# EAGLE design CarDAC (EAGLE 7.6.0)
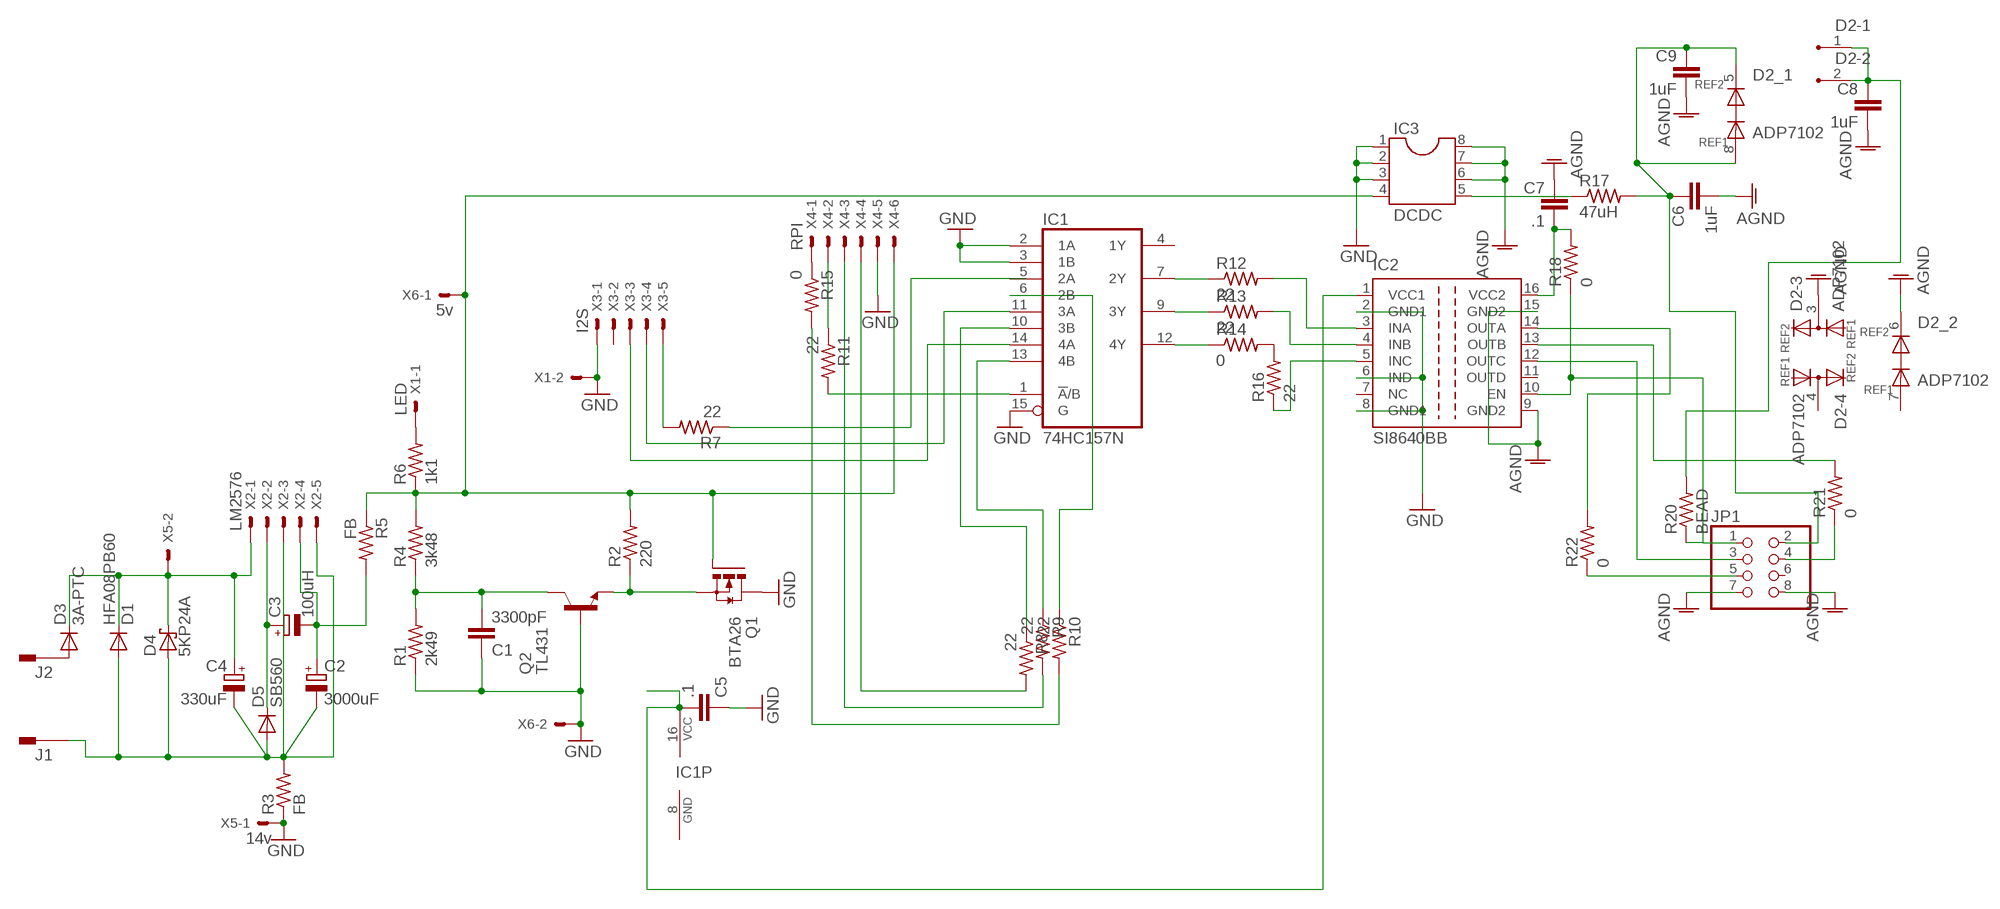
[diagram p0: schematic, sheet 1]

## Parts
C1  3300pF  C-EU050-035X075  [C050-035X075]
C2  3000uF  CPOL-EUE5-10.5  [E5-10,5]
C3  100uH  CPOL-EUB45181C  [B45181C]
C4  330uF  CPOL-EUE5-10.5  [E5-10,5]
C5  .1  C-EUC1210K  [C1210K]
C6  1uF  C-EUC1210K  [C1210K]
C7  .1  C-EUC1210K  [C1210K]
C8  1uF  C-EUC1210K  [C1210K]
C9  1uF  C-EUC1210K  [C1210K]
D1  HFA08PB60  1N5061  [SOD57-10]
D2  ADP7102  DA108S1  [SO08]
D3  3A-PTC  1N5061  [SOD57-10]
D4  5KP24A  5KPXX  [P6T15]
D5  SB560  1N5400  [DO201-15]
IC1  74HC157N  74LS157N  [DIL16]
IC2  SI8640BB  ISO7240  [SO-16DW]
IC3  DCDC  DIL8  [DIL08]
J1  PIN2F061.040  [F061.040]
J2  PIN2F061.040  [F061.040]
JP1  PINHD-2X4  [2X04]
Q1  BTA26  IRFP240  [TO247BV]
Q2  TL431  BC449  [TO92-EBC]
R1  2k49  R-US_0309/10  [0309/10]
R2  220  R-US_0309/10  [0309/10]
R3  FB  R-US_0309/10  [0309/10]
R4  3k48  R-US_0309/10  [0309/10]
R5  FB  R-US_0309/12  [0309/12]
R6  1k1  R-US_0309/10  [0309/10]
R7  22  R-US_0309/12  [0309/12]
R8  22  R-US_0207/15  [0207/15]
R9  22  R-US_0309/12  [0309/12]
R10  22  R-US_0309/12  [0309/12]
R11  22  R-US_0309/12  [0309/12]
R12  22  R-US_0309/10  [0309/10]
R13  22  R-US_0309/12  [0309/12]
R14  0  R-US_0207/15  [0207/15]
R15  0  R-US_0309/12  [0309/12]
R16  22  R-US_0207/15  [0207/15]
R17  47uH  R-US_0309/10  [0309/10]
R18  0  R-US_0309/10  [0309/10]
R20  BEAD  R-US_0309/10  [0309/10]
R21  0  R-US_0207/15  [0207/15]
R22  0  R-US_0309/10  [0309/10]
X1  LED  22-23-2021  [22-23-2021]
X2  LM2576  22-23-2051  [22-23-2051]
X3  I2S  22-23-2051  [22-23-2051]
X4  RPI  22-23-2061  [22-23-2061]
X5  14v  22-23-2021  [22-23-2021]
X6  5v  22-23-2021  [22-23-2021]

## Nets
AGND: C6.2 C7.1 C8.2 C9.2 D2.3(-3:K) D2.6(_2:REF2) IC2.9(GND2) IC2.15(GND2) IC3.6 IC3.7 IC3.8 JP1.7 JP1.8
GND: C1.1 C5.1 IC1.2(1A) IC1.3(1B) IC1.15(G) IC2.2(GND1) IC2.6(IND) IC2.8(GND1) IC3.1 IC3.2 IC3.3 Q1.D Q2.B R1.1 R3.1 X1.2 X3.1 X4.5 X5.1 X6.2
N$1: Q1.S Q2.E R2.1
N$2: IC3.4 Q1.G R2.2 R4.2 R5.1 R6.1 X4.6 X6.1
N$3: C1.2 Q2.C R1.2 R4.1
N$4: C4.+ D1.C D3.C D4.C X2.1 X5.2
N$5: D3.A J2.A1 J2.A2
N$6: C2.- C4.- D1.A D4.A D5.A J1.A1 J1.A2 R3.2 X2.3 X2.5
N$7: C3.+ D5.C X2.2
N$8: C2.+ C3.- R5.2 X2.4
N$9: R6.2 X1.1
N$10: C5.2 IC1.16(VCC) IC2.1(VCC1)
N$11: IC1.13(4B) R9.1
N$12: IC1.14(4A) X3.3
N$13: IC1.12(4Y) R14.1
N$14: IC1.10(3B) R8.1
N$15: IC1.11(3A) X3.4
N$16: IC1.6(2B) R10.1
N$17: IC1.5(2A) R7.1
N$18: R7.2 X3.5
N$19: R10.2 R15.2
N$20: IC1.1(!A!/B) R11.2
N$21: R9.2 X4.3
N$22: R8.2 X4.4
N$23: R11.1 X4.2
N$24: IC1.7(2Y) R12.1
N$25: IC1.9(3Y) R13.1
N$26: R15.1 X4.1
N$27: IC2.3(INA) R12.2
N$28: IC2.4(INB) R13.2
N$29: IC2.5(INC) R16.1
N$30: IC3.5 R17.1
N$31: R14.2 R16.2
N$32: C6.1 C9.1 D2.5(_1:REF2) D2.8(_1:REF1) JP1.2 R17.2
N$34: IC2.10(EN) JP1.1 R18.1 R20.1
N$35: C8.1 D2.1(-1:K) D2.2(-2:K) R20.2
N$36: IC2.12(OUTC) JP1.3
N$37: IC2.13(OUTB) R21.2
N$38: IC2.14(OUTA) R22.2
N$39: JP1.5 R22.1
N$40: C7.2 IC2.16(VCC2) R18.2
N$44: JP1.4 R21.1
Unconnected: D2.4(-4:K) D2.7(_2:REF1) IC1.4(1Y) IC2.7(NC) IC2.11(OUTD) JP1.6 X3.2

## Power pins joined to a net without a drawn wire
GND: IC1.8(GND)

## Library data of the parts
C1 C5-C9 = resistor:C-EU: CAPACITOR, European symbol
C2-C4 = resistor:CPOL-EU: POLARIZED CAPACITOR, European symbol
D1 D3 = diode:1N5061: DIODE controlled avalanche rectifier
D2 = st-microelectronics:DA108S1: DIODE ARRAY (ASD); MF: Arrow Electronics; MPN: DA108S1; OC_FARNELL: 9802215; OC_NEWARK: 89K0513
D4 = diode:5KPXX: DIODE transient voltage suppressor
D5 = diode:1N5400: DIODE standard rectifier, 3 A, 50 V (Motorola)
IC1 = 74xx-us:74*157: Quadruple 2-line to 1-line data SELECTOR/MULTIPLEXER
IC2 = texas:ISO7240: HIGH SPEED QUAD DIGITAL ISOLATORS Source: http://focus.ti.com/lit/ds/symlink/iso7240m.pdf; MPN: ISO7240MDW; OC_FARNELL: 1755124; OC_NEWARK: 58M0385
IC3 = ic-package:DIL8: Dual In Line / Socket
J1 J2 = con-faston:PIN2: Flachstecker Typ Tyco/Electronics/AMP TAB, FASTON Printed Circuit Board Tabs Source: http://www.buerklin.com, http://catalog.tycoelectronics.com; OC_FARNELL: unknown; OC_NEWARK: unknown
JP1 = pinhead:PINHD-2X4: PIN HEADER
Q1 = transistor-power:IRFP240: HEXFET Power MosFet Source: http://www.irf.com/
Q2 = transistor-npn:BC449*: NPN Transistor
R1-R18 R20-R22 = resistor:R-US_: RESISTOR, American symbol
X1 X5 X6 = con-molex:22-23-2021: .100" (2.54mm) Center Header - 2 Pin; MF: MOLEX; MPN: 22-23-2021; OC_FARNELL: 1462926; OC_NEWARK: 25C3832
X2 X3 = con-molex:22-23-2051: .100" (2.54mm) Center Header - 5 Pin; MF: MOLEX; MPN: 22-23-2051; OC_FARNELL: 1462952; OC_NEWARK: 38C9178
X4 = con-molex:22-23-2061: .100" (2.54mm) Center Header - 6 Pin; MF: MOLEX; MPN: 22-23-2061; OC_FARNELL: 1462922; OC_NEWARK: 27C1933

## Board
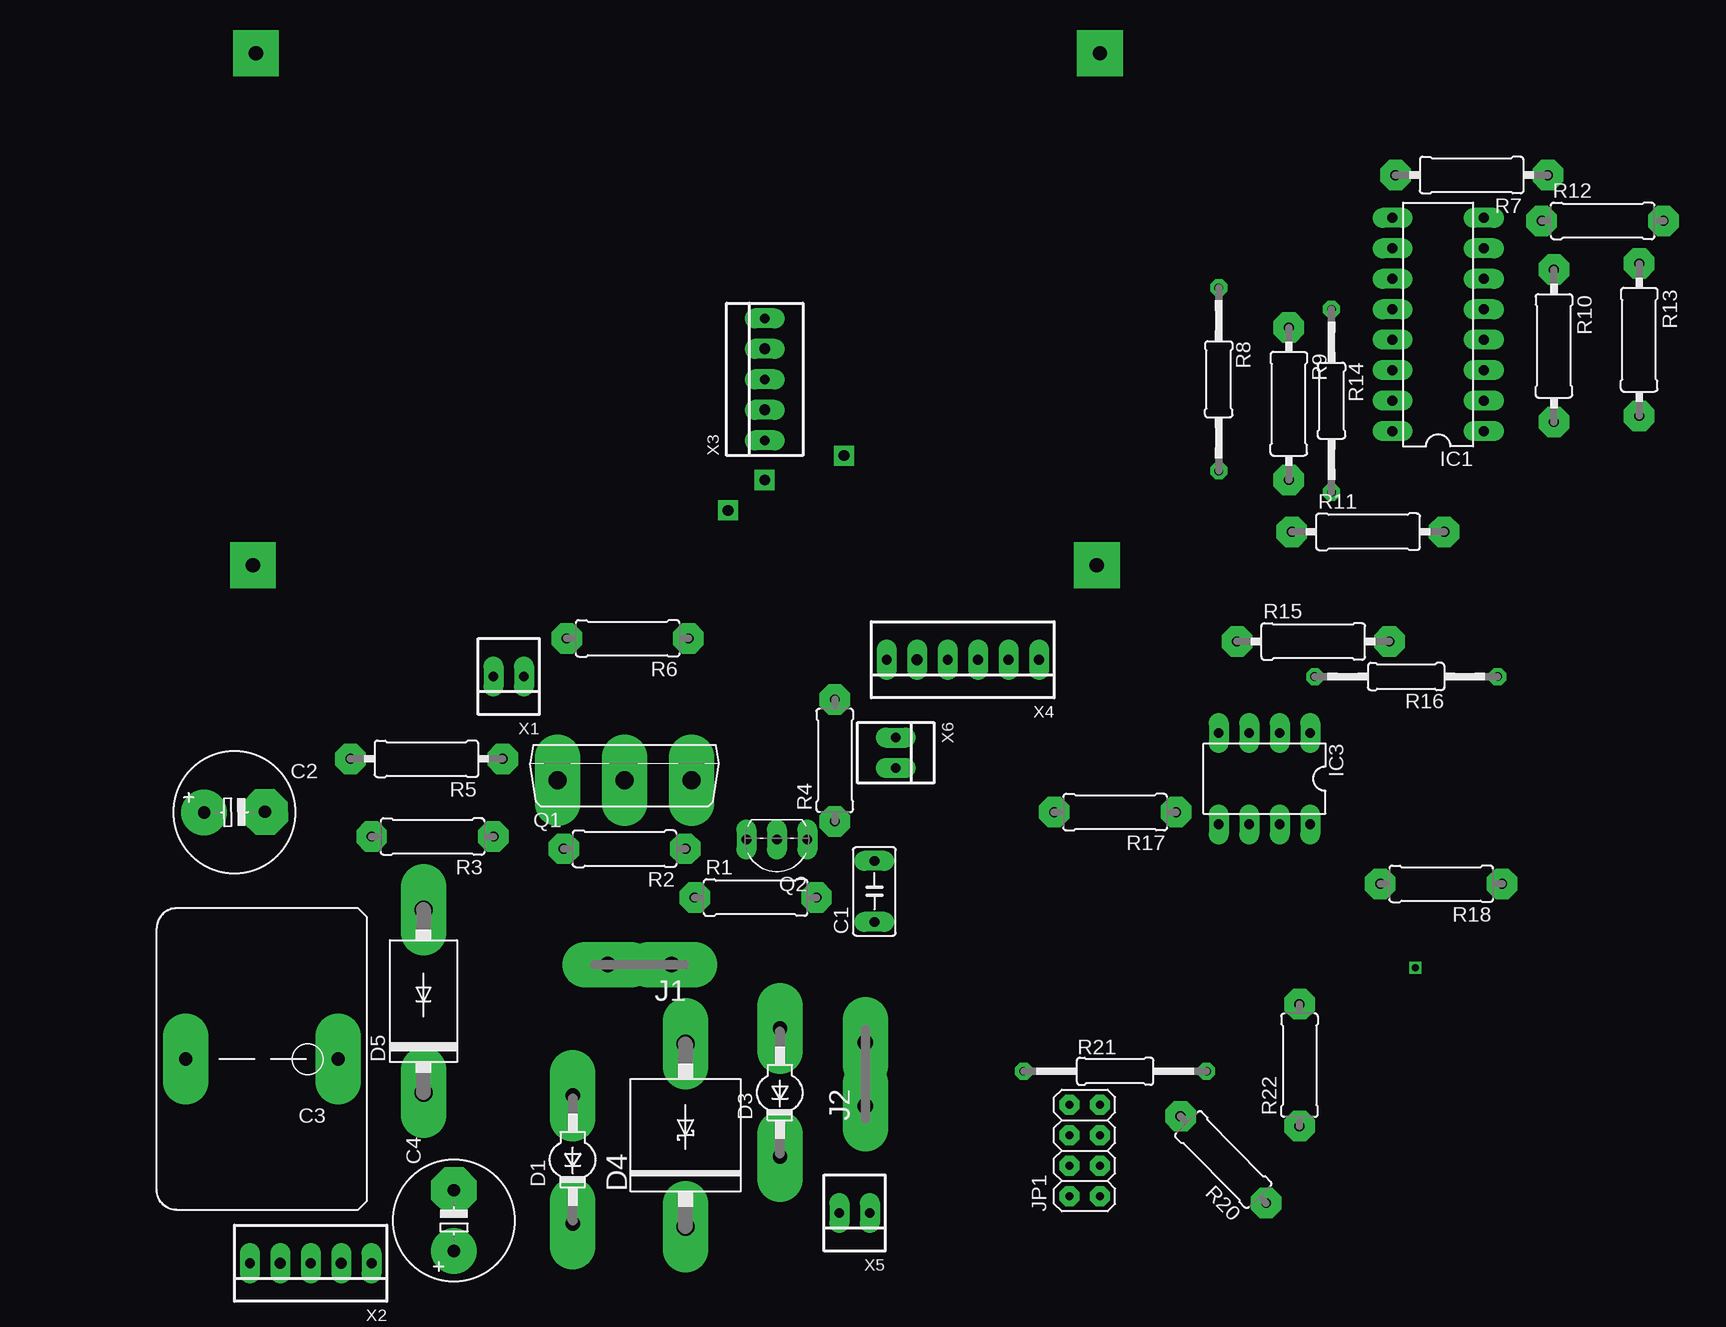
[diagram p1: board, top side]
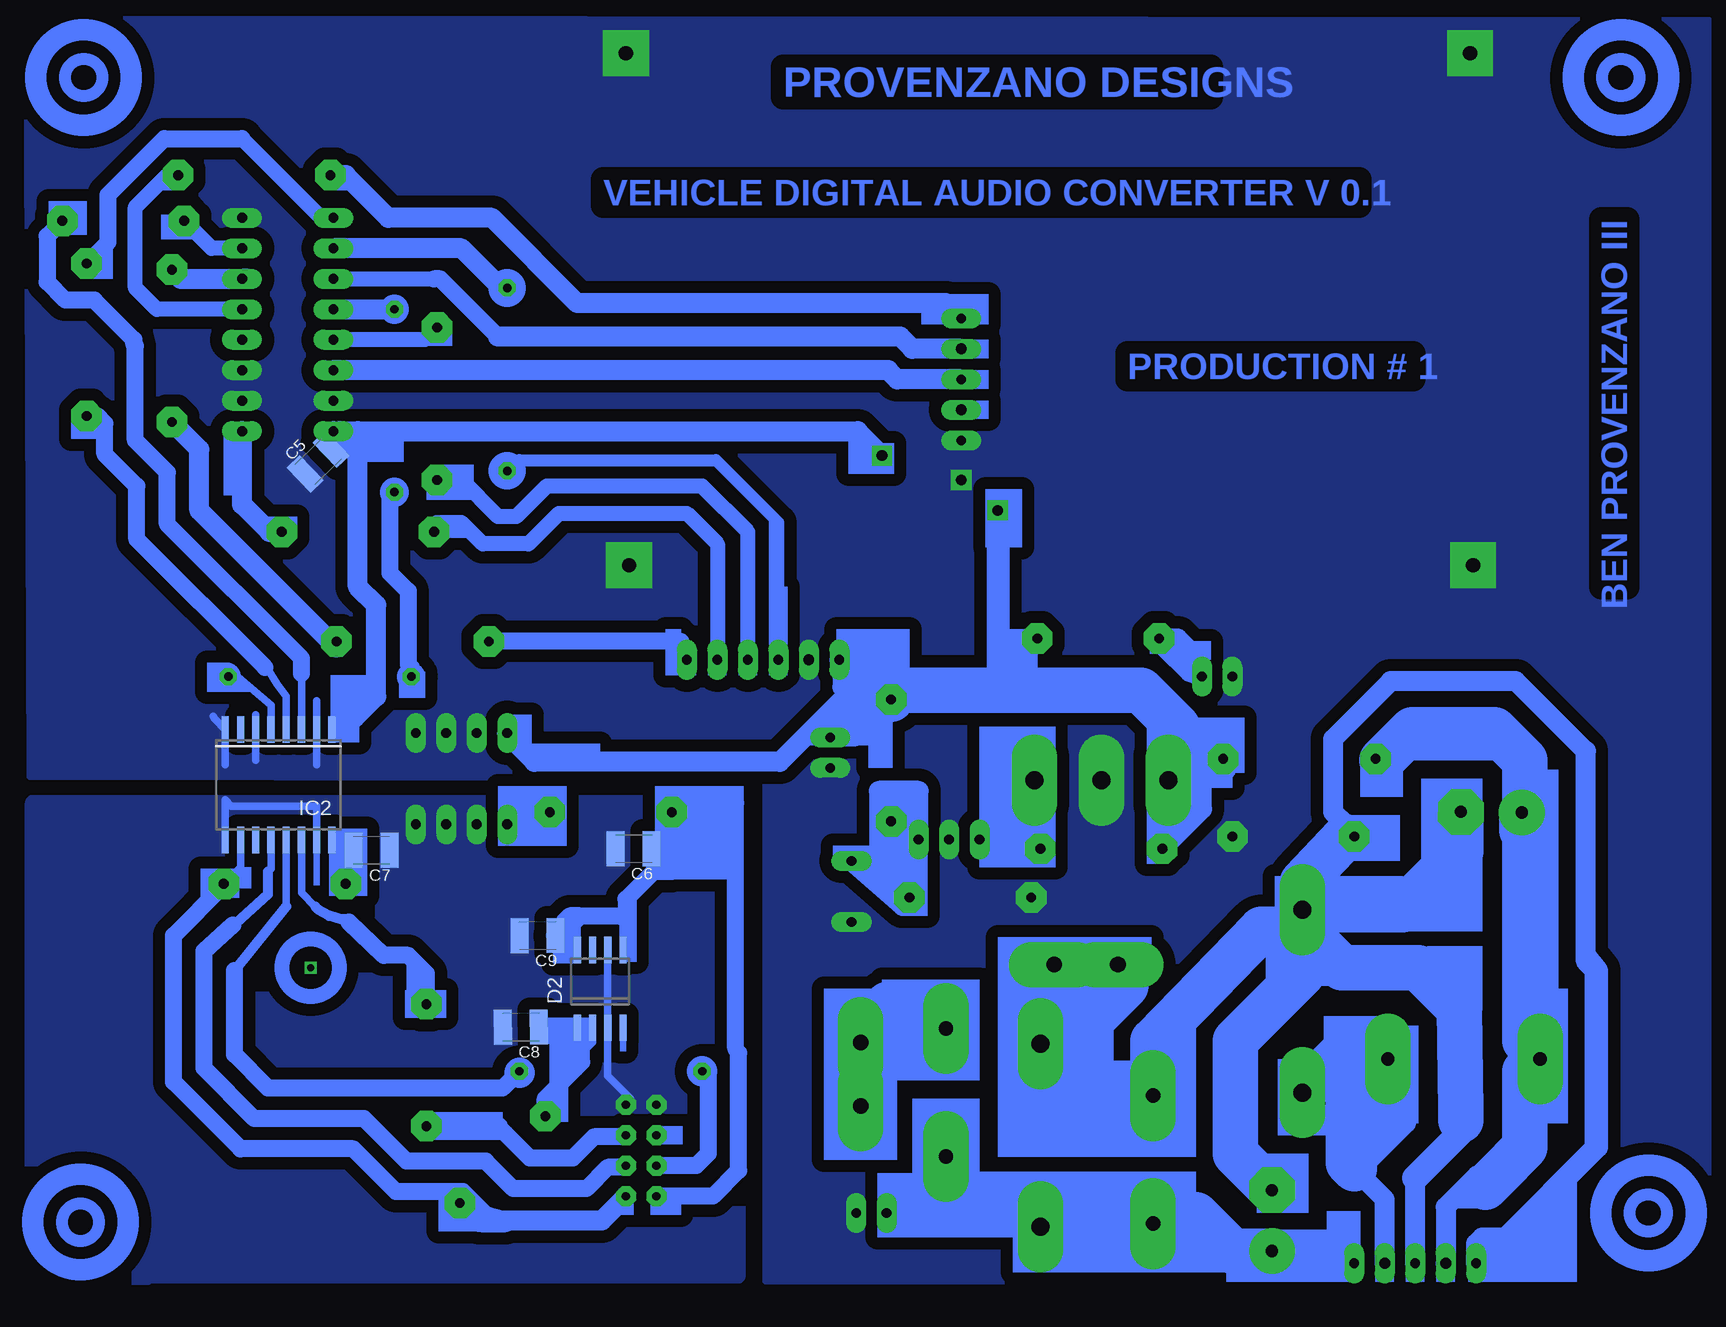
[diagram p2: board, bottom side, seen from below]

No outline drawn. Coordinates in mm, seen from the top.
Copper layers (1*16): Top 0.035mm / dielectric 1.5mm / Bottom 0.035mm
Design rules "default": minimum track width 10mil, minimum drill 24mil, track to track 8mil, track to pad 8mil, pad to pad 8mil, via to via 8mil, smd to smd 8mil, copper to edge 40mil, drill to drill 8mil, minimum pad ring 10mil, minimum via ring 8mil, stop-mask expansion 4mil, vias tented up to drill 0mil, thermal gap 10mil

### Footprints (pad centres in the part's own frame; a part is rotated, then mirrored left to right if it is on the bottom)
C050-035X075 = drill 0.813 pad 1.676 long: 1 -2.54,0; 2 2.54,0
E5-10,5 = drill 1.016 pad 3.81: + -2.54,0 | drill 1.016 pad 3.81 octagon: - 2.54,0
B45181C = drill 1.1 pad 3.81 long: + -6.35,0; - 6.35,0
C1210K = smd 1.5 x 2.9: 1 -1.5,0; 2 1.5,0
SOD57-10 = drill 1.194 pad 3.81 long: A 5.334,0; C -5.334,0
SO08 = smd 0.6 x 2.2: 1 -1.905,-3.87; 2 -0.635,-3.87; 3 0.635,-3.87; 4 1.905,-3.87; 5 1.905,2.6; 6 0.635,2.6; 7 -0.635,2.6; 8 -1.905,2.6
P6T15 = drill 1.499 pad 3.81 long: A 7.62,0; C -7.62,0
DO201-15 = drill 1.499 pad 3.81 long: A 7.62,0; C -7.62,0
DIL16 = drill 0.813 pad 1.676 long: 1 -8.89,-3.81; 2 -6.35,-3.81; 3 -3.81,-3.81; 4 -1.27,-3.81; 5 1.27,-3.81; 6 3.81,-3.81; 7 6.35,-3.81; 8 8.89,-3.81; 9 8.89,3.81; 10 6.35,3.81; 11 3.81,3.81; 12 1.27,3.81; 13 -1.27,3.81; 14 -3.81,3.81; 15 -6.35,3.81; 16 -8.89,3.81
SO-16DW = smd 0.6 x 2.2: 1 -4.445,-4.6; 2 -3.175,-4.6; 3 -1.905,-4.6; 4 -0.635,-4.6; 5 0.635,-4.6; 6 1.905,-4.6; 7 3.175,-4.6; 8 4.445,-4.6; 9 4.445,4.6; 10 3.175,4.6; 11 1.905,4.6; 12 0.635,4.6; 13 -0.635,4.6; 14 -1.905,4.6; 15 -3.175,4.6; 16 -4.445,4.6
DIL08 = drill 0.813 pad 1.676 long: 1 -3.81,-3.81; 2 -1.27,-3.81; 3 1.27,-3.81; 4 3.81,-3.81; 5 3.81,3.81; 6 1.27,3.81; 7 -1.27,3.81; 8 -3.81,3.81
F061.040 = drill 1.3 pad 3.81 long: A1 -2.65,0; A2 2.65,0
2X04 = drill 0.7 pad 1.676 octagon: 1 -3.81,-1.27; 2 -3.81,1.27; 3 -1.27,-1.27; 4 -1.27,1.27; 5 1.27,-1.27; 6 1.27,1.27; 7 3.81,-1.27; 8 3.81,1.27
TO247BV = drill 1.499 pad 3.81 long: D 0,-2.921; G -5.588,-2.921; S 5.588,-2.921
TO92-EBC = drill 0.813 pad 1.676 long: B 0,-1.27; C -2.54,-1.27; E 2.54,-1.27
0309/10 = drill 0.813 pad 2.54 octagon: 1 -5.08,0; 2 5.08,0
0309/12 = drill 0.813 pad 2.54 octagon: 1 -6.35,0; 2 6.35,0
0207/15 = drill 0.7 pad 1.422 octagon: 1 -7.62,0; 2 7.62,0
22-23-2021 = drill 0.8 pad 1.676 long: 1 -1.27,0; 2 1.27,0
22-23-2051 = drill 0.8 pad 1.676 long: 1 -5.08,0; 3 0,0; 5 5.08,0 | drill 0.9 pad 1.676 long: 2 -2.54,0; 4 2.54,0
22-23-2061 = drill 0.8 pad 1.676 long: 1 -6.35,0; 2 -3.81,0; 3 -1.27,0; 4 1.27,0; 6 6.35,0 | drill 0.9 pad 1.676 long: 5 3.81,0

### Placement (x,y rotation side)
C1  87.88,55.12 90 top
C2  34.54,61.72 0.6 top
C3  36.83,41.15 180 top
C4  52.83,27.69 90 top
C5  132.33,90.93 43.8 bottom
C6  106.05,58.67 180 bottom
C7  127.89,58.55 180 bottom
C8  115.44,43.81 180.3 bottom
C9  114.05,51.44 180.2 bottom
D1  62.74,32.77 90 top
D2  108.84,47.62 0 bottom
D3  80.01,38.35 90 top
D4  72.14,34.8 90 top
D5  50.29,45.97 90 top
IC1  134.87,102.36 90 top
IC2  135.64,64.01 180 bottom
IC3  120.4,64.52 180 top
J1  68.33,49.02 180 top
J2  87.12,39.88 90 top
JP1  105.41,33.53 90 top
Q1  67.06,67.31 0 top
Q2  79.76,58.17 180 top
R1  77.98,54.61 0 top
R2  67.06,58.67 180 top
R3  51.05,59.69 180 top
R4  84.58,66.04 90 top
R5  50.55,66.17 180 top
R6  67.31,76.2 180 top
R7  137.67,114.81 180 top
R8  116.59,97.79 270 top
R9  122.43,95.76 270 top
R10  144.53,100.58 270 top
R11  129.03,85.09 0 top
R12  148.59,111 0 top
R13  151.64,101.09 270 top
R14  125.98,96.01 270 top
R15  124.46,75.95 0 top
R16  132.21,73.03 180 top
R17  107.95,61.72 180 top
R18  135.13,55.75 180 top
R20  116.97,32.77 134.6 top
R21  107.95,40.13 0 top
R22  123.32,40.64 90 top
X1  57.4,73.03 180 top
X2  40.89,24.13 180 top
X3  78.74,97.79 90 top
X4  95.25,74.42 180 top
X5  86.23,28.32 180 top
X6  89.66,66.67 270 top

### Tracks (layer width: path | path; a pad name or v marks a point on that pad's centre or on a via)
AGND
  Bottom 0.61: IC2.15 132.46,62.23 139.57,62.23 140.08,62.74 IC2.9 | D2.3 108.2,41.15 | D2.6 D2.3 | D2.3 108.2,39.75 106.3,37.85
  pour Bottom (isolate 1.016, no thermals): 97.41,62.48 97.41,23.11 146.69,23.11 146.69,22.99 156.08,22.99 156.08,62.48
GND  (via drill 0.9 pad 1.68, 1.2 pad 3.81)
  Bottom 0.61: 141.1,69.72 140.97,69.5 IC2.8 140.08,65.66 | 137.54,66.04 IC2.6 137.54,69.85 | 132.46,65.66 IC2.2 132.46,70.99
  other vias: 36.32,124.97 36.07,82.3 106.68,124.97 106.43,82.3 78.74,89.41
  pour Bottom (isolate 1.016, no thermals): 16.38,127.76 156.72,127.89 156.46,64.64 95.12,64.52 95.12,22.61 16.38,22.61
N$1
  Bottom 1.676: 74.68,60.96 74.68,62.36 Q1.S | Q2.E 74.68,60.96 | R2.1 74.68,60.96
N$2  (via drill 0.9 pad 1.68)
  Bottom 1.422: X6.1 87.5,67.94 87.5,72.14
  Bottom 1.676: 61.98,63.88 Q1.G 61.47,65.02 61.72,65.28 58.67,65.28 | R5.1 56.64,65.28 58.67,65.28 | R2.2 58.67,61.98 58.67,65.28 | X4.6 88.65,75.44 88.65,72.14 88.27,72.14 | 88.27,72.14 87.5,72.14 83.06,72.14 83.06,71.88 | R6.1 72.39,75.95 75.69,72.64 | 88.27,72.14 88.27,71.5 93.85,65.91 114.3,65.91 116.59,68.2 IC3.4
  Bottom 1.93: v75.69,86.87 75.69,72.64 75.69,71.88
  Bottom 3.81: Q1.G 60.71,65.15 60.71,68.83 63.75,71.88 75.69,71.88 83.06,71.88 84.58,71.88 R4.2
N$3
  Bottom 1.676: Q2.C 82.3,63.5 85.6,63.5 85.6,57.91 83.6,55.91 83.6,53.91 | R1.2 83.57,57.15 C1.2 83.6,53.91 | 83.6,53.91 R4.1
N$4
  Bottom 1.422: X5.2 80.64,28.32 80.01,28.19
  Bottom 1.676: X2.1 46.48,25.15 53.34,25.15
  Bottom 3.81: C4.+ 53.34,25.15 56.13,25.15 59.18,28.19 62.74,28.19 | 62.74,28.19 71.88,28.19 | D1.C 62.74,28.19 | D4.C 71.88,28.19 | 71.88,28.19 80.01,28.19 D3.C
N$5
  Bottom 3.81: J2.A1 J2.A2 87.12,43.43 84.84,45.72 D3.A
N$6
  Bottom 1.422: 46.74,59.69 R3.2
  Bottom 1.676: X2.3 40.89,31.24 | 26.67,49.78 26.67,49.28 25.91,48.51 25.91,33.78 33.4,26.29 35.31,26.29 35.81,25.78 X2.5 34.54,24.64 33.27,25.91 33.27,26.16 25.65,33.78 25.65,48.51 26.67,49.78 | 26.67,49.78 26.67,66.8 32.51,72.64 42.93,72.64 47.75,67.82 47.75,61.72 46.74,60.71 46.74,59.69
  Bottom 2.184: 40.89,31.24 37.09,35.04 37.09,36.82
  Bottom 3.81: 50.29,53.09 49.95,51.96 53.7,51.96 62.74,42.67 62.74,39.12 | 46.74,59.69 50.29,55.88 D5.A | 50.29,53.09 D5.A | C4.- 55.88,33.27 55.88,42.67 50.29,48.26 50.29,52.07 | 62.74,39.12 D1.A | 62.74,39.12 69.09,39.12 D4.A 70.36,41.91 65.02,47.24 65.02,48.37 J1.A2 J1.A1 | 37.08,36.07 37.09,36.82 37.21,45.34 40.64,48.77 46.99,48.77 50.29,52.07 | 50.29,52.07 50.29,53.09 | D5.A 41.97,53.59 37.08,58.48 C2.-
N$7
  Bottom 1.676: X2.2 43.43,29.46 45.72,31.75 41.66,35.81 41.66,39.37 43.18,40.89 C3.+
  Bottom 3.81: 45.97,32 46.48,32.51 46.48,40.64 45.72,41.4 | 45.72,41.4 C3.+ | D5.C 47.24,41.4 45.72,41.4
N$8
  Bottom 1.422: R5.2 43.69,66.17 43.69,66.04
  Bottom 1.676: X2.4 38.35,28.83 35.75,31.43 34.1,31.43
  Bottom 3.81: 31.75,59.94 31.75,42.67 C3.- 31.75,40.13 31.75,33.78 34.1,31.43 35.05,30.48 | 31.75,59.94 32,60.2 C2.+ | 43.69,66.04 41.15,68.58 34.29,68.58 31.75,66.04 31.75,59.94
N$9
  Bottom 1.676: R6.2 61.72,76.2 | 61.72,76.2 60.71,76.2 58.93,74.42 58.93,73.66 | X1.1 59.69,73.41 61.72,75.44 61.72,76.2
N$10  (via drill 0.9 pad 1.68)
  Bottom 0.61: IC2.1 130.2,69.6 129.29,69.6
  Bottom 1.422: C5.2 130.56,92.67 130.56,93.47
  Bottom 1.676: IC1.16 130.56,93.47 129.03,93.47 | 129.03,93.47 87.38,93.47 v85.34,91.44 | 129.29,69.6 127.51,71.37 127.51,78.99 129.03,80.52 129.03,93.47
N$11
  Bottom 1.27: R9.1 123.44,101.09 IC1.13
N$12
  Bottom 1.676: X3.3 84.07,97.79 84.84,98.55 IC1.14 131.83,98.55
N$13
  Bottom 1.676: IC1.12 R14.1
N$14
  Bottom 1.676: IC1.10 120.4,108.71 117.09,105.41 R8.1
N$15
  Bottom 1.27: IC1.11 122.68,106.17
  Bottom 1.422: 117.35,101.35 122.17,106.17 122.68,106.17
  Bottom 1.676: X3.4 82.8,100.33 83.82,101.35 117.35,101.35
N$16
  Bottom 1.676: R10.1 143.76,106.17 139.19,106.17 IC1.6 138.18,106.17
N$17
  Bottom 1.27: R7.1 144.91,114.81 147.57,112.14 147.57,105.41 145.8,103.63 IC1.5
N$18
  Bottom 1.676: X3.5 80.01,104.14 110.74,104.14 117.86,111.25 126.49,111.25 130.05,114.81 R7.2
N$19
  Bottom 1.422: R15.2 130.56,75.69 130.3,75.69 130.56,75.44 130.81,75.44
  Bottom 1.676: 130.81,75.44 142.24,86.87 142.24,91.95 R10.2
N$20
  Bottom 1.676: IC1.1 138.68,87.38 136.4,85.09 R11.2
N$21
  Bottom 1.27: X4.3 96.52,85.09 100.33,88.9 113.28,88.9 115.82,86.36 117.35,86.36 120.4,89.41 R9.2
N$22
  Bottom 1.016: R8.2 115.57,91.06 99.19,91.06 93.98,85.85 X4.4
N$23
  Bottom 1.27: X4.2 99.06,84.07 101.6,86.61 112.27,86.61 114.81,84.07 118.62,84.07 120.4,85.85 122.43,85.85 R11.1
N$24
  Bottom 1.27: IC1.7 141.22,108.71 R12.1
N$25
  Bottom 1.27: IC1.9 132.08,111.25 138.68,117.86
  Bottom 1.422: R13.1 149.86,109.22 149.86,113.16 145.16,117.86 138.68,117.86
N$26
  Bottom 1.422: X4.1 102.11,75.95 R15.1
N$27
  Bottom 0.61: IC2.3 133.73,73.28
  Bottom 1.422: 133.73,73.28 133.73,74.55 144.91,85.72 144.91,90.04 147.57,92.71 147.57,100.58 147.7,100.71 147.7,101.09 151,104.39 153.42,104.39 154.94,105.92 154.94,109.73 R12.2
N$28
  Bottom 0.61: IC2.4 135,71.37 135.76,72.39 136.65,73.79 136.78,73.79
  Bottom 1.422: 136.78,73.79 147.45,84.45 147.45,88.9 150.11,91.57 150.11,94.11 150.75,94.74 R13.2
N$29
  Bottom 0.61: IC2.5 136.27,70.61 139.06,73.03 R16.1
N$30
  Bottom 1.676: IC3.5 115.57,61.72 R17.1
N$31
  Bottom 1.422: R14.2 126.36,88.01 126.36,81.66 124.84,80.14 124.84,74.04 124.59,73.79 R16.2
N$32
  Bottom 0.406: C6.1 103.76,58.67 103.76,56.77
  Bottom 0.61: D2.5 106.93,52.96 110.62,52.96 110.74,52.83 D2.8
  Bottom 1.422: JP1.2 99.44,29.72 97.28,31.88 97.28,41.66 97.54,42.04 97.54,62.48 101.35,62.48 | 110.49,53.09 111.38,53.09 111.76,52.7 111.76,51.82 111.51,52.07 110.49,53.09 | 110.49,53.09 107.06,53.09 106.93,52.96 106.68,52.96 106.68,54.48 104.39,56.77 103.76,56.77 102.87,56.77 102.55,57.09 | 101.35,62.48 101.35,58.29 102.55,57.09 | 102.3,57.09 102.55,57.09 | 101.35,62.48 101.35,62.99
  Bottom 1.676: R17.2 101.35,62.99 | 111.63,52.16 C9.1 112.02,52.07 111.51,52.07
N$34
  Bottom 0.61: R18.1 138.81,57.15 IC2.10
  Bottom 1.422: R20.1 119.45,28.07 118.36,28.07 118.24,28.07 120.27,30.1 125.86,30.1 129.41,33.66 138.81,33.66 144.4,39.24 144.4,51.44 140.21,55.63 R18.1
  Bottom 1.676: 118.36,28.07 116.97,27.69 108.71,27.69 JP1.1 | R20.1 119.2,27.81 119,27.81 118.75,27.56 | 118.75,27.56 116.71,27.56 | 118.75,27.56 118.94,27.56
N$35
  Bottom 0.61: D2.2 109.47,42.55 110.11,41.91 110.36,42.16 110.74,42.55 | 110.74,42.55 110.87,42.67 111.38,41.66 110.89,41.43 C8.1 | 110.74,42.55 D2.1
  Bottom 1.422: R20.2 113.41,37.85 110.36,40.89 110.36,42.16
N$36
  Bottom 0.61: 136.53,56.77 136.27,57.02 IC2.12
  Bottom 0.813: 139.45,52.32 139.19,52.45 136.53,54.86 136.53,56.77
  Bottom 1.422: 139.45,52.32 141.86,50.16 141.86,40.39 137.67,36.2 128.52,36.2 124.97,32.64 118.36,32.64 116.08,30.35 109.98,30.35 108.2,32.13 106.81,32.13 JP1.3
N$37
  Bottom 0.61: 135,53.85 IC2.13
  Bottom 0.813: 139.32,48.51 135,53.85
  Bottom 1.422: R21.2 116.97,38.73 136.53,38.73 139.32,41.53 139.32,48.51
N$38
  Bottom 0.61: 132.59,53.85 133.73,54.99 IC2.14
  Bottom 0.813: 129.79,52.58 131.44,53.09 132.33,53.59 132.59,53.85
  Bottom 1.422: R22.2 123.32,48.26 124.84,49.78 126.87,49.78 129.79,52.58
N$39
  Bottom 1.422: R22.1 117.22,35.56 117.22,35.43 114.68,32.89 111.12,32.89 109.35,34.67 106.81,34.67 JP1.5
N$40
  Bottom 0.61: IC2.16 130.94,59.15 130.94,56.64 130.56,57.02 130.05,57.02
  Bottom 1.422: C7.2 130.05,57.89 130.05,57.02 R18.2 130.05,55.24
N$41  (via drill 0.6)
  other vias: 132.97,48.77
N$44
  Bottom 1.422: 99.95,39.62 99.82,39.62 99.82,33.27 100.84,32.26 JP1.4
  Bottom 1.676: 99.95,39.62 R21.1
(copper drawn outside any net)
  shapes: Bottom area x204, Bottom circle x18

### Text on the board
Bottom: PROVENZANO DESIGNS | VEHICLE DIGITAL AUDIO CONVERTER V 0.1 | BEN PROVENZANO III | PRODUCTION # 1